# EAGLE design handset (EAGLE 5.07)
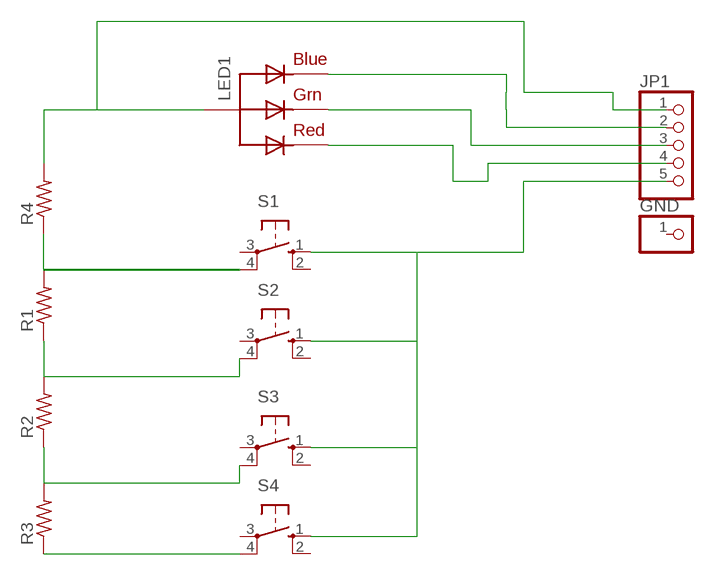
[diagram p0: schematic, sheet 1]

## Parts
GND  PINHD-1X1  [1X01]
JP1  PINHD-1X5  [1X05]
LED1  RGBLED_CA-PIRANHA  [PIRANHA5MM]
R1  R-US_0207/7  [0207/7]
R2  R-US_0207/7  [0207/7]
R3  R-US_0207/7  [0207/7]
R4  R-US_0207/7  [0207/7]
S1  10-XX  [B3F-10XX]
S2  10-XX  [B3F-10XX]
S3  10-XX  [B3F-10XX]
S4  10-XX  [B3F-10XX]

## Nets
N$1: R1.1 R2.2 S2.4(P1)
N$2: R2.1 R3.2 S3.4(P1)
N$3: R3.1 S4.4(P1)
N$4: JP1.1 LED1.4(VCC) R4.2
N$5: JP1.5 S1.1(S) S2.1(S) S3.1(S) S4.1(S)
N$6: JP1.2 LED1.1(BLUE)
N$7: JP1.3 LED1.3(GREEN)
N$8: JP1.4 LED1.2(RED)
N$9: R1.2 R4.1 S1.4(P1)
Unconnected: GND.1 S1.2(S1) S1.3(P) S2.2(S1) S2.3(P) S3.2(S1) S3.3(P) S4.2(S1) S4.3(P)

## Library data of the parts
GND = adafruit:PINHD-1X1: Pin header 1x1 for 0.1" spacing With round pins
JP1 = pinhead:PINHD-1X5: PIN HEADER
LED1 = adafruit:RGBLED_CA: RGB LED, common-anode 5MM Staggered pins 5mm Piranha package http://www.ladyada.net/library/pcb/eaglelibrary.html
R1-R3 = rcl:R-US_: RESISTOR, American symbol
R4 = resistor:R-US_: RESISTOR, American symbol
S1-S4 = switch-omron:10-XX: OMRON SWITCH; MPN: B3F-1000; OC_FARNELL: 176432; OC_NEWARK: 36M3542

## Board
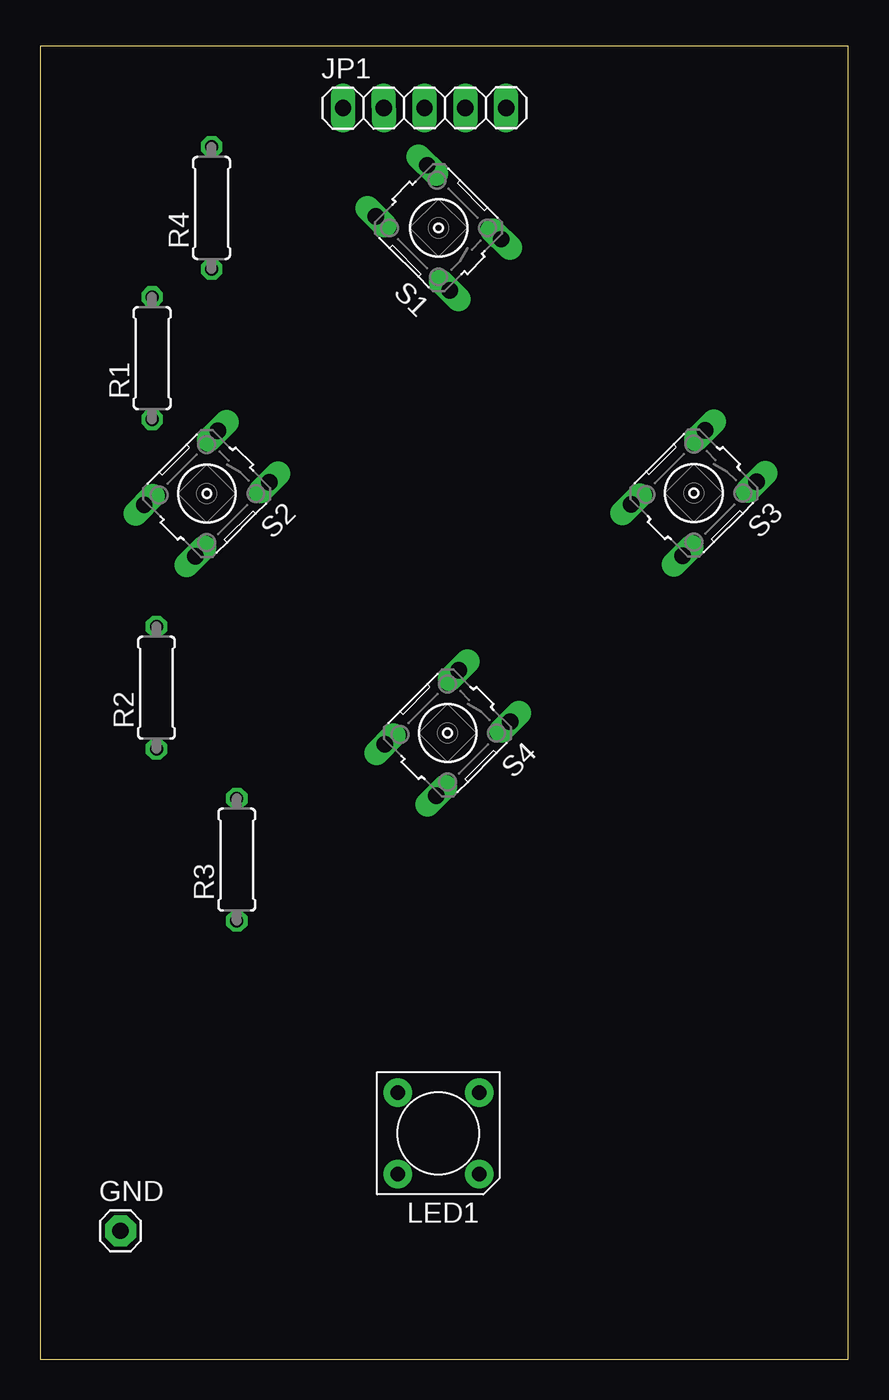
[diagram p1: board, top side]
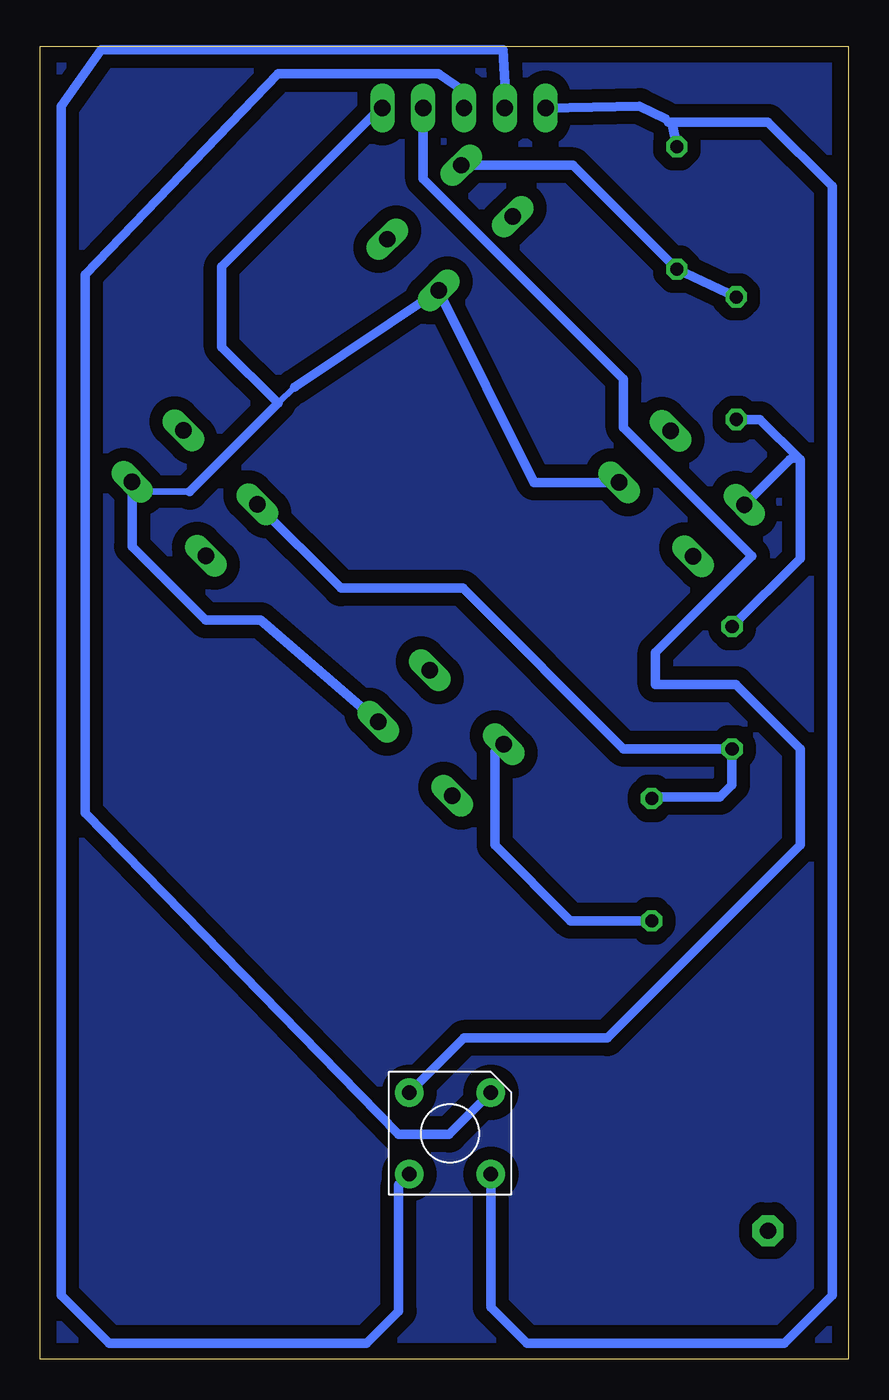
[diagram p2: board, bottom side, seen from below]

Size 50.31 x 81.73 mm. Coordinates in mm from the lower left corner, seen from the top.
Outline: 0,0 50.31,0 50.31,81.73 0,81.73 0,0
Copper layers (1*16): Top 0.035mm / dielectric 1.5mm / Bottom 0.035mm
Design rules "default *": minimum track width 10mil, minimum drill 24mil, track to track 8mil, track to pad 8mil, pad to pad 8mil, via to via 8mil, smd to smd 8mil, copper to edge 40mil, drill to drill 8mil, minimum pad ring 10mil, minimum via ring 8mil, stop-mask expansion 4mil, vias tented up to drill 0mil, thermal gap 10mil

### Footprints (pad centres in the part's own frame; a part is rotated, then mirrored left to right if it is on the bottom)
1X01 = drill 1.016 pad 1.93 octagon: 1 0,0
1X05 = drill 1.016 long: 1 -5.08,0; 2 -2.54,0; 3 0,0; 4 2.54,0; 5 5.08,0
PIRANHA5MM = drill 0.9 pad 1.778 round: 1 -2.54,2.54; 2 -2.54,-2.54; 3 2.54,-2.54; 4 2.54,2.54
0207/7 = drill 0.813 octagon: 1 -3.81,0; 2 3.81,0
B3F-10XX = drill 1.016 long: 1 -3.251,2.261; 2 3.251,2.261; 3 -3.251,-2.261; 4 3.251,-2.261

### Placement (x,y rotation side)
GND  5,8 0 top
JP1  23.93,77.88 0.1 top
LED1  24.79,14.07 180 top
R1  6.97,62.31 90 top
R2  7.24,41.8 90 top
R3  12.24,31.1 90 top
R4  10.67,71.66 90 top
S1  24.8,70.42 135 top
S2  10.37,53.88 225 top
S3  40.69,53.91 225 top
S4  25.36,38.98 225 top

### Tracks (layer width: path | path; a pad name or v marks a point on that pad's centre or on a via)
GND
  pour Bottom (isolate 0.813): 0,82 50,82 50,0 0,0
N$1
  Bottom 0.406: 3,56 3.65,56
  Bottom 0.6: R1.1 5.5,58.5 3,56 3,49.85 R2.2 | 3.65,56 S2.4
N$2
  Bottom 0.6: R3.2 12.15,35 8,35 7.24,35.76 R2.1 13.99,37.99 24,48 31.58,48 S3.4
N$3
  Bottom 0.6: R3.1 17.29,27.29 22,32 22,37.82 S4.4
N$4
  Bottom 0.406: 11,77 11.4,77.2 11.2,77
  Bottom 0.6: JP1.1 13,78 11.4,77.2 | 11,77 R4.2 | LED1.4 22.25,3.25 20,1 4,1 1,4 1,73 5,77 11.2,77
N$5
  Bottom 0.406: 34.48,60.52 35.5,59.5 | 41,54 43.98,54 | 29.11,77.89 JP1.5
  Bottom 0.6: S2.1 19.56,54.58 S1.1 34.48,60.52 | 41,54 35.5,59.5 39,63 39,68 29.11,77.89 | 43.98,54 S3.1 44.59,50.59 40,46 36.58,46 S4.1
N$6
  Bottom 0.6: JP1.2 21.39,79.39 21.5,81.5 46.5,81.5 49,78 49,4 46,1 30,1 28,3 28,10.86 LED1.1
N$7
  Bottom 0.6: JP1.3 23.93,78.93 25.5,80 35.5,80 47.5,67.5 47.5,34 28,14 24.86,14 LED1.3
N$8
  Bottom 0.6: JP1.4 26.47,73.47 14,61 14,58 6,50 12,44 12,42 7,42 3,38 3,32 15,20 23.94,20 LED1.2
N$9
  Bottom 0.6: R1.2 R4.1 17.14,74.32 S1.4